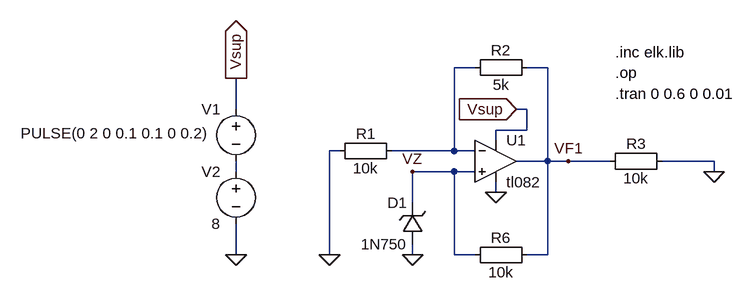
[diagram p0: schematic 10_2_TW.asc]
10_2_TW.asc, the LTspice schematic file:
Version 4
SHEET 1 1112 680
WIRE 96 112 64 112
WIRE 208 112 176 112
WIRE -272 176 -272 128
WIRE 176 176 160 176
WIRE 176 208 176 176
WIRE 176 208 128 208
WIRE 128 224 128 208
WIRE -112 240 -128 240
WIRE 64 240 64 112
WIRE 64 240 -32 240
WIRE 96 240 64 240
WIRE 208 256 208 112
WIRE 208 256 160 256
WIRE 240 256 208 256
WIRE 304 256 240 256
WIRE 464 256 384 256
WIRE -272 272 -272 256
WIRE 64 272 0 272
WIRE 96 272 64 272
WIRE 464 272 464 256
WIRE 128 304 128 288
WIRE 0 320 0 272
WIRE -272 400 -272 352
WIRE -128 400 -128 240
WIRE 0 400 0 384
WIRE 64 400 64 272
WIRE 96 400 64 400
WIRE 208 400 208 256
WIRE 208 400 176 400
FLAG -128 400 0
FLAG 128 304 0
FLAG 464 272 0
FLAG 0 400 0
FLAG 160 176 Vsup
IOPIN 160 176 In
FLAG 0 272 VZ
FLAG 240 256 VF1
FLAG -272 400 0
FLAG -272 128 Vsup
IOPIN -272 128 Out
SYMBOL Misc\\EuropeanResistor -16 256 M270
WINDOW 0 27 56 VTop 2
WINDOW 3 5 56 VBottom 2
SYMATTR InstName R1
SYMATTR Value 10k
SYMBOL zener 16 384 R180
WINDOW 0 24 64 Left 2
WINDOW 3 24 0 Left 2
SYMATTR InstName D1
SYMATTR Value 1N750
SYMBOL Opamps\\opamp2 128 192 R0
SYMATTR InstName U1
SYMATTR Value tl082
SYMBOL Misc\\EuropeanResistor 192 96 R90
WINDOW 0 5 56 VBottom 2
WINDOW 3 27 56 VTop 2
SYMATTR InstName R2
SYMATTR Value 5k
SYMBOL Misc\\EuropeanResistor 400 240 R90
WINDOW 0 5 56 VBottom 2
WINDOW 3 27 56 VTop 2
SYMATTR InstName R3
SYMATTR Value 10k
SYMBOL Misc\\EuropeanResistor 192 384 R90
WINDOW 0 5 56 VBottom 2
WINDOW 3 27 56 VTop 2
SYMATTR InstName R6
SYMATTR Value 10k
SYMATTR SpiceLine tol=1 pwr=0.1
SYMBOL voltage -272 160 M0
WINDOW 3 41 53 Left 2
WINDOW 123 0 0 Left 0
WINDOW 39 0 0 Left 0
SYMATTR Value PULSE(0 2 0 0.1 0.1 0 0.2)
SYMATTR InstName V1
SYMBOL voltage -272 256 M0
WINDOW 123 0 0 Left 0
WINDOW 39 0 0 Left 0
SYMATTR InstName V2
SYMATTR Value 8
TEXT 312 88 Left 2 !.inc elk.lib
TEXT 312 120 Left 2 !.op
TEXT 312 152 Left 2 !.tran 0 0.6 0 0.01

The netlist it stands for:
* 10_2_TW.asc
R1 N001 0 10k
D1 0 VZ 1N750
XU1 VZ N001 Vsup 0 VF1 tl082  ; pins In+ In- V+ V- OUT
R2 VF1 N001 5k
R3 0 VF1 10k
R6 VF1 VZ 10k tol=1 pwr=0.1
V1 Vsup N002 PULSE(0 2 0 0.1 0.1 0 0.2)
V2 N002 0 8
.model D D
.lib standard.dio
.inc elk.lib
.op
.tran 0 0.6 0 0.01
.backanno
.end